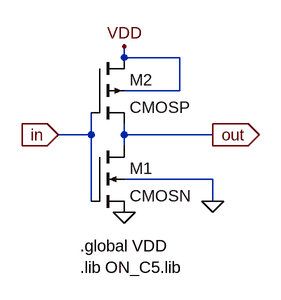
[diagram p0: schematic inverter.asc]
inverter.asc, the LTspice schematic file:
Version 4
SHEET 1 900 680
WIRE 160 112 160 96
WIRE 240 112 160 112
WIRE 240 160 240 112
WIRE 240 160 160 160
WIRE 112 224 112 192
WIRE 112 224 64 224
WIRE 160 224 160 208
WIRE 288 224 160 224
WIRE 160 240 160 224
WIRE 288 288 160 288
WIRE 112 320 112 224
WIRE 288 320 288 288
FLAG 288 224 out
IOPIN 288 224 Out
FLAG 64 224 in
IOPIN 64 224 In
FLAG 160 336 0
FLAG 288 320 0
FLAG 160 96 VDD
SYMBOL nmos4 112 240 R0
SYMATTR InstName M1
SYMATTR Value CMOSN
SYMATTR Value2 l=0.6u w=0.9u
SYMBOL pmos4 112 112 R0
SYMATTR InstName M2
SYMATTR Value CMOSP
SYMATTR Value2 l=0.6u w=1.8u
TEXT 96 384 Left 2 !.global VDD\n.lib ON_C5.lib

The netlist it stands for:
* inverter.asc
M1 out in 0 0 CMOSN l=0.6u w=0.9u
M2 VDD in out VDD CMOSP l=0.6u w=1.8u
.model NMOS NMOS
.model PMOS PMOS
.lib standard.mos
.global VDD
.lib ON_C5.lib
.backanno
.end